# Altium schematic sheet Sheet1.SchDoc
size A4; SheetNumber: 2; SheetTotal: 3
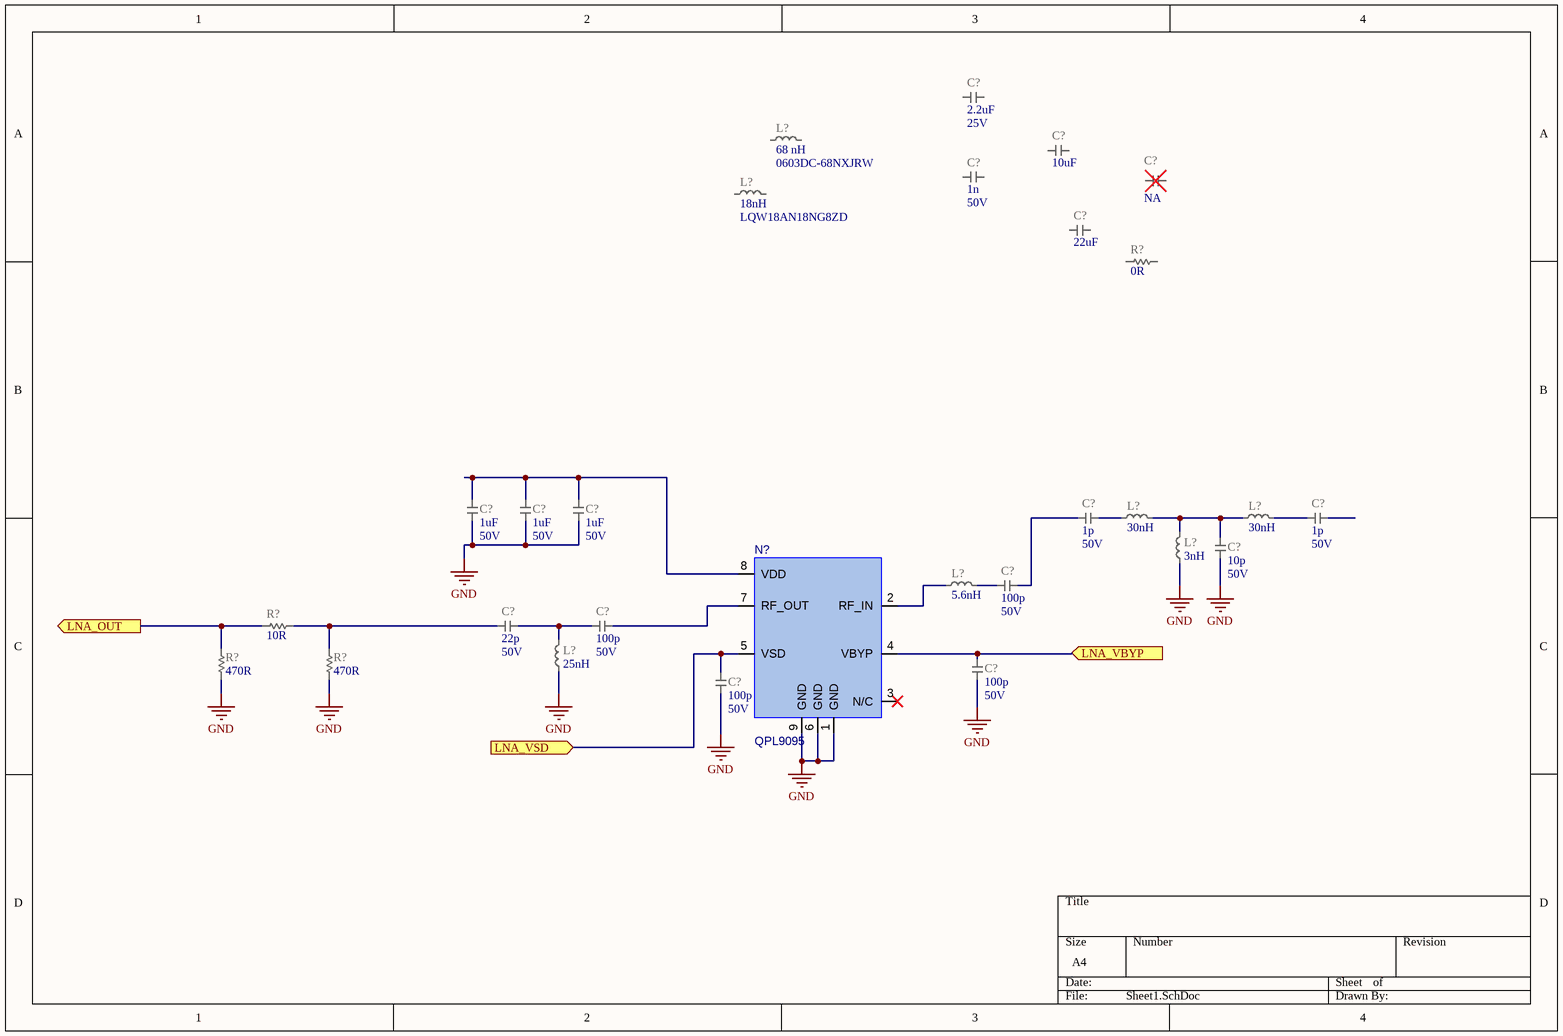
[diagram p0: Sheet1.SchDoc]

## Parts
(Parts that share a designator on the sheet are numbered #1, #2 ... from top to bottom, then left to right.)
C?#1  value 2.2uF  Voltage: 25V  [CAP_0603_UN1Q]  (hidden comment: CAP_0603_2u2_25V_X7R)
C?#2  value 10uF  [CAP_0603_UN1Q]  (hidden comment: CAP_0603_10u_10V_X7R)
C?#3  value 1n  Voltage: 50V  [CAP_0603_UN1Q]  (hidden comment: CAP_0603_1n_100V_X7R)
C?#4  value NA  [CAP_0603_UN1Q]  (hidden comment: CAP_0603_NA)
C?#5  value 22uF  [CAP_0603_UN1Q]  (hidden comment: CAP_0603_22u_6.3V_X6S)
C?#6  value 1uF  Voltage: 50V  [CAP_0603_UN1Q]  (hidden comment: CAP_0603_1u_X7R)
C?#7  value 1uF  Voltage: 50V  [CAP_0603_UN1Q]  (hidden comment: CAP_0603_1u_X7R)
C?#8  value 1uF  Voltage: 50V  [CAP_0603_UN1Q]  (hidden comment: CAP_0603_1u_X7R)
C?#9  value 1p  Voltage: 50V  [CAP_0603_UN1Q]  (hidden comment: CAP_0603_1p)
C?#10  value 1p  Voltage: 50V  [CAP_0603_UN1Q]  (hidden comment: CAP_0603_1p)
C?#11  value 10p  Voltage: 50V  [CAP_0603_UN1Q]  (hidden comment: CAP_0603_10p)
C?#12  value 100p  Voltage: 50V  [CAP_0603_UN1Q]  (hidden comment: CAP_0603_100p)
C?#13  value 22p  Voltage: 50V  [CAP_0603_UN1Q]  (hidden comment: CAP_0603_22p)
C?#14  value 100p  Voltage: 50V  [CAP_0603_UN1Q]  (hidden comment: CAP_0603_100p)
C?#15  value 100p  Voltage: 50V  [CAP_0603_UN1Q]  (hidden comment: CAP_0603_100p)
C?#16  value 100p  Voltage: 50V  [CAP_0603_UN1Q]  (hidden comment: CAP_0603_100p)
L?#1  value 68 nH  Part Number: 0603DC-68NXJRW  [IND_0603_Coilcraft_0603DC]  (hidden comment: IND_0603_68nH_Coilcraft_DC)
L?#2  value 18nH  Part Number: LQW18AN18NG8ZD  [IND_0603_UN1Q_LQW]  (hidden comment: IND_0603_18nH_LQW)
L?#3  value 30nH  [IND_0603_UN1Q]  (hidden comment: IND_0603_30n)
L?#4  value 30nH  [IND_0603_UN1Q]  (hidden comment: IND_0603_30n)
L?#5  value 3nH  [IND_0603_UN1Q]  (hidden comment: IND_0603_3n)
L?#6  value 5.6nH  [IND_0603_UN1Q]  (hidden comment: IND_0603_5_6n)
L?#7  value 25nH  [IND_0603_UN1Q]  (hidden comment: IND_0603_25n)
N?  QPL9095  [DFN8_P50_200x200x95_QORVO]
R?#1  value 0R  [RES_0603_UN1Q]  (hidden comment: RES_0603_0R)
R?#2  value 10R  [RES_0603_UN1Q]  (hidden comment: RES_0603_10R)
R?#3  value 470R  [RES_0603_UN1Q]  (hidden comment: RES_0603_470R)
R?#4  value 470R  [RES_0603_UN1Q]  (hidden comment: RES_0603_470R)

## Ports
LNA_OUT (out), LNA_VBYP (in), LNA_VSD (in)

## Nets
GND: C?#6.1 C?#7.1 C?#8.1 C?#11.1 C?#15.1 C?#16.1 L?#5.1 L?#7.1 N?.1(GND) N?.6(GND) N?.9(GND) R?#3.1 R?#4.1
LNA_OUT: R?#2.1 R?#3.2 ; port LNA_OUT
LNA_VBYP: C?#15.2 N?.4(VBYP) ; port LNA_VBYP
LNA_VSD: C?#16.2 N?.5(VSD) ; port LNA_VSD
NetC?#6_2: C?#6.2 C?#7.2 C?#8.2 N?.8(VDD)
NetC?#9_1: C?#9.1 L?#3.1
NetC?#9_2: C?#9.2 C?#12.1
NetC?#10_2: C?#10.2 L?#4.2
NetC?#11_2: C?#11.2 L?#3.2 L?#4.1 L?#5.2
NetC?#12_2: C?#12.2 L?#6.2
NetC?#13_1: C?#13.1 C?#14.2 L?#7.2
NetC?#13_2: C?#13.2 R?#2.2 R?#4.2
NetC?#14_1: C?#14.1 N?.7(RF_OUT)
NetL?#6_1: L?#6.1 N?.2(RF_IN)

Not connected (* = marked no-connect by the designer): C?#1 1 2; C?#2 1 2; C?#3 1 2; C?#4 1 2; C?#5 1 2; C?#10 1; L?#1 1 2; L?#2 1 2; N? 3(N/C)*; R?#1 1 2

## Library data of the parts
C?#1 = CMP-001-001421-2: CAP; Part Number: GRM188Z71E225ME43D; Manufacturer: Murata; Temperature characteristics: X7R; Tolerance: +/-20%; Sort order: 306; HasBeenBuilt: TBD; Alternative component: Allowed; System: RLC; Package: 0603; ComponentLink1Description: 1_Datasheet; ComponentLink2Description: 2_Product page; ComponentLink3Description: 3_X-information; ComponentLink4Description: 4_X-information; Creation date: 20250605; Manufacturer Part Number: GRM188Z71E225ME43D; Component Type: Capacitor
C?#2 = CMP-001-001253-9: CAP; Part Number: GRM188Z71A106KA73D; Manufacturer: Murata; Voltage: 10V; Tolerance: +/-10%; Temperature characteristics: X7R; Sort order: 306; Alternative component: Allowed; System: RLC; Package: 0603; ComponentLink1Description: 1_Datasheet; ComponentLink2Description: 2_Product page; ComponentLink3Description: 3_X-information; ComponentLink4Description: 4_X-information; Creation date: 20240404; Manufacturer Part Number: GRM188Z71A106KA73D; Component Type: Capacitor
C?#3 C?#9-C?#16 = CMP-001-000378-11: CAP; Manufacturer: Murata; Part Number: GCM188R71H102KA37J; Temperature characteristics: X7R; HasBeenBuilt: TBD; System: RLC; Alternative component: Allowed; Sort order: 306; Tolerance: +/-10%; Creation date: 20210927; Package: 0603; ComponentLink4Description: 4_X-information; ComponentLink2Description: 2_Product page; ECCN: EAR99; RoHS: RoHS3; Operating temperature range: -55 ... +125°C; ComponentLink3Description: 3_X-information; Source: RLC_UN1Q.SchLib; ComponentLink1Description: 1_Datasheet; Manufacturer Part Number: GCM188R71H102KA37J; Component Type: Capacitor
C?#4 = CMP-001-000259-10: Not Assembled - CAP; Sort order: 999; System: RLC; HasBeenBuilt: TBD; Creation date: 20190101; Package: 0603; Source: RLC_UN1Q.SchLib; ComponentLink3Description: 3_X-information; ComponentLink1Description: 1_Datasheet; ComponentLink2Description: 2_Product page; ComponentLink4Description: 4_X-information; Component Type: Capacitor
C?#5 = CMP-001-000890-13: CAP; Part Number: GRM188C80J226ME15D; Manufacturer: Murata; Voltage: 6.3V; Tolerance: +/-20%; Temperature characteristics: X6S; Sort order: 306; HasBeenBuilt: TBD; Alternative component: Allowed; System: RLC; Package: 0603; ComponentLink1Description: 1_Datasheet; ComponentLink2Description: 2_Product page; ComponentLink3Description: 3_X-information; ComponentLink4Description: 4_X-information; Creation date: 26042024; Manufacturer Part Number: GRM188C80J226ME15D; Component Type: Capacitor
C?#6-C?#8 = CMP-001-000333-14: CAP; Part Number: UMK107AB7105KA-T; Manufacturer: Taiyo Yuden; Tolerance: +/-20%; Sort order: 306; HasBeenBuilt: TBD; Alternative component: Allowed; Temperature characteristics: X7R; System: RLC; Package: 0603; ComponentLink1Description: 1_Datasheet; ComponentLink2Description: 2_Product page; ComponentLink3Description: 3_X-information; ComponentLink4Description: 4_X-information; Creation date: 20210917; Source: RLC_UN1Q.SchLib; Manufacturer Part Number: UMK107AB7105KA-T; Component Type: Capacitor
L?#1 = CMP-001-001491-1: IND High Q Ceramic Chip; System: RLC; Tolerance: 10%; Sort order: 346; Dimensions WxLxH: 1.7 x 0.99 x 0.89; ComponentLink3Description: 3_X-information; Creation date: 20250807; ComponentLink1Description: 1_Datasheet; Package: 0603; ComponentLink1URL: https://www.coilcraft.com/en-us/products/rf/ceramic-core-chip-inductors/0603-(1608)/0603dc/?skuId=30647; Manufacturer: Coilcraft; ComponentLink2Description: 2_Product page; Operating temperature range: -55℃ to 125℃; ComponentLink4Description: 4_X-information; ECCN: EAR99; RoHS: RoHS 3; Manufacturer Part Number: 0603DC-68NXJRW; Component Type: Inductor
L?#2 = CMP-001-001409-3: IND High Q Wirewound, 1.4A; Manufacturer: Murata; Tolerance: 2%; System: RLC; Sort order: 346; Package: 0603; ComponentLink2Description: 2_Product page; Dimensions WxLxH: 1.09 x 1.75 x 1.00; ComponentLink3Description: 3_X-information; Creation date: 20250103; ComponentLink1Description: 1_Datasheet; ComponentLink1URL: https://www.mouser.fi/datasheet/2/281/JELF243A_9133-1518463.pdf; Operating temperature range: -55℃ to 125℃; ComponentLink4Description: 4_X-information; Current: 1.4 A; Manufacturer Part Number: LQW18AN18NG8ZD; Component Type: Inductor
L?#3-L?#7 = CMP-034-000025-11: Manufacturer: TDK; Manufacturer Part Number: MLZ1608M100WTD25; Desc2: inductor_10uH_1R_250mA; Sort order: 346; Tolerance: 10%; HasBeenBuilt: False; Package: 0603; Dimensions WxLxH: 1.6 x 0.8 x 0.8 +-0.15; HasBeenChecked: False; ComponentLink1Description: 1_Datasheet; ComponentLink1URL: https://product.tdk.com/en/search/inductor/inductor/smd/info?part_no=MLZ1608M100WTD25; ComponentLink2Description: 2_Product page; ComponentLink3Description: 3_X-information; ComponentLink4Description: 4_X-information; Creation date: 20230111; Component Type: Inductor
N? = CMP-001-001198-7: Ultra Low-Noise, Bypass LNA; Manufacturer: Qorvo; Manufacturer Part Number: QPL9095SR; Sort order: 721; System: RF; ComponentLink4Description: 4_X-information; ComponentLink2URL: https://www.qorvo.com/products/p/QPL9095; ClassName: BIG; ComponentLink1Description: 1_Datasheet; Operating temperature range: -40°C ... 105°C; Package: DFN50; ComponentLink1URL: https://www.qorvo.com/products/d/da006183; Creation Date: 20240607; ComponentLink3Description: 3_X-information; ComponentLink3URL: https://www.qorvo.com/products/d/da006076; ComponentLink2Description: 2_Product page; Dimensions WxLxH: 2 x 2 x 0.95; Part Number: QPL9095; Component Type: RF IC
R?#1 = CMP-001-000441-13: RES; Manufacturer: YAGEO; Part Number: RC0603FR-070RL; Alternative component: Allowed; HasBeenBuilt: TBD; Tolerance: 5%; Sort order: 326; Power Rating: 1/10W; System: RLC; ComponentLink2Description: 2_Product page; Source: RLC_UN1Q.SchLib; ComponentLink3Description: 3_X-information; ComponentLink1Description: 1_Datasheet; Package: 0603; Creation date: 20190101; ComponentLink4Description: 4_X-information; Component Type: Resistor
R?#2-R?#4 = CMP-001-000441-13: RES; Manufacturer: YAGEO; Alternative component: Allowed; HasBeenBuilt: TBD; Tolerance: 5%; Sort order: 326; Power Rating: 1/10W; System: RLC; ComponentLink2Description: 2_Product page; Source: RLC_UN1Q.SchLib; ComponentLink3Description: 3_X-information; ComponentLink1Description: 1_Datasheet; Package: 0603; Creation date: 20190101; ComponentLink4Description: 4_X-information; Component Type: Resistor